# Altium schematic sheet PowerManagement.SchDoc: Teknofest Project
size 381 x 241 mm; SheetNumber: 3; SheetTotal: 4; Prepared by: Mustafa Oğuz Ateş
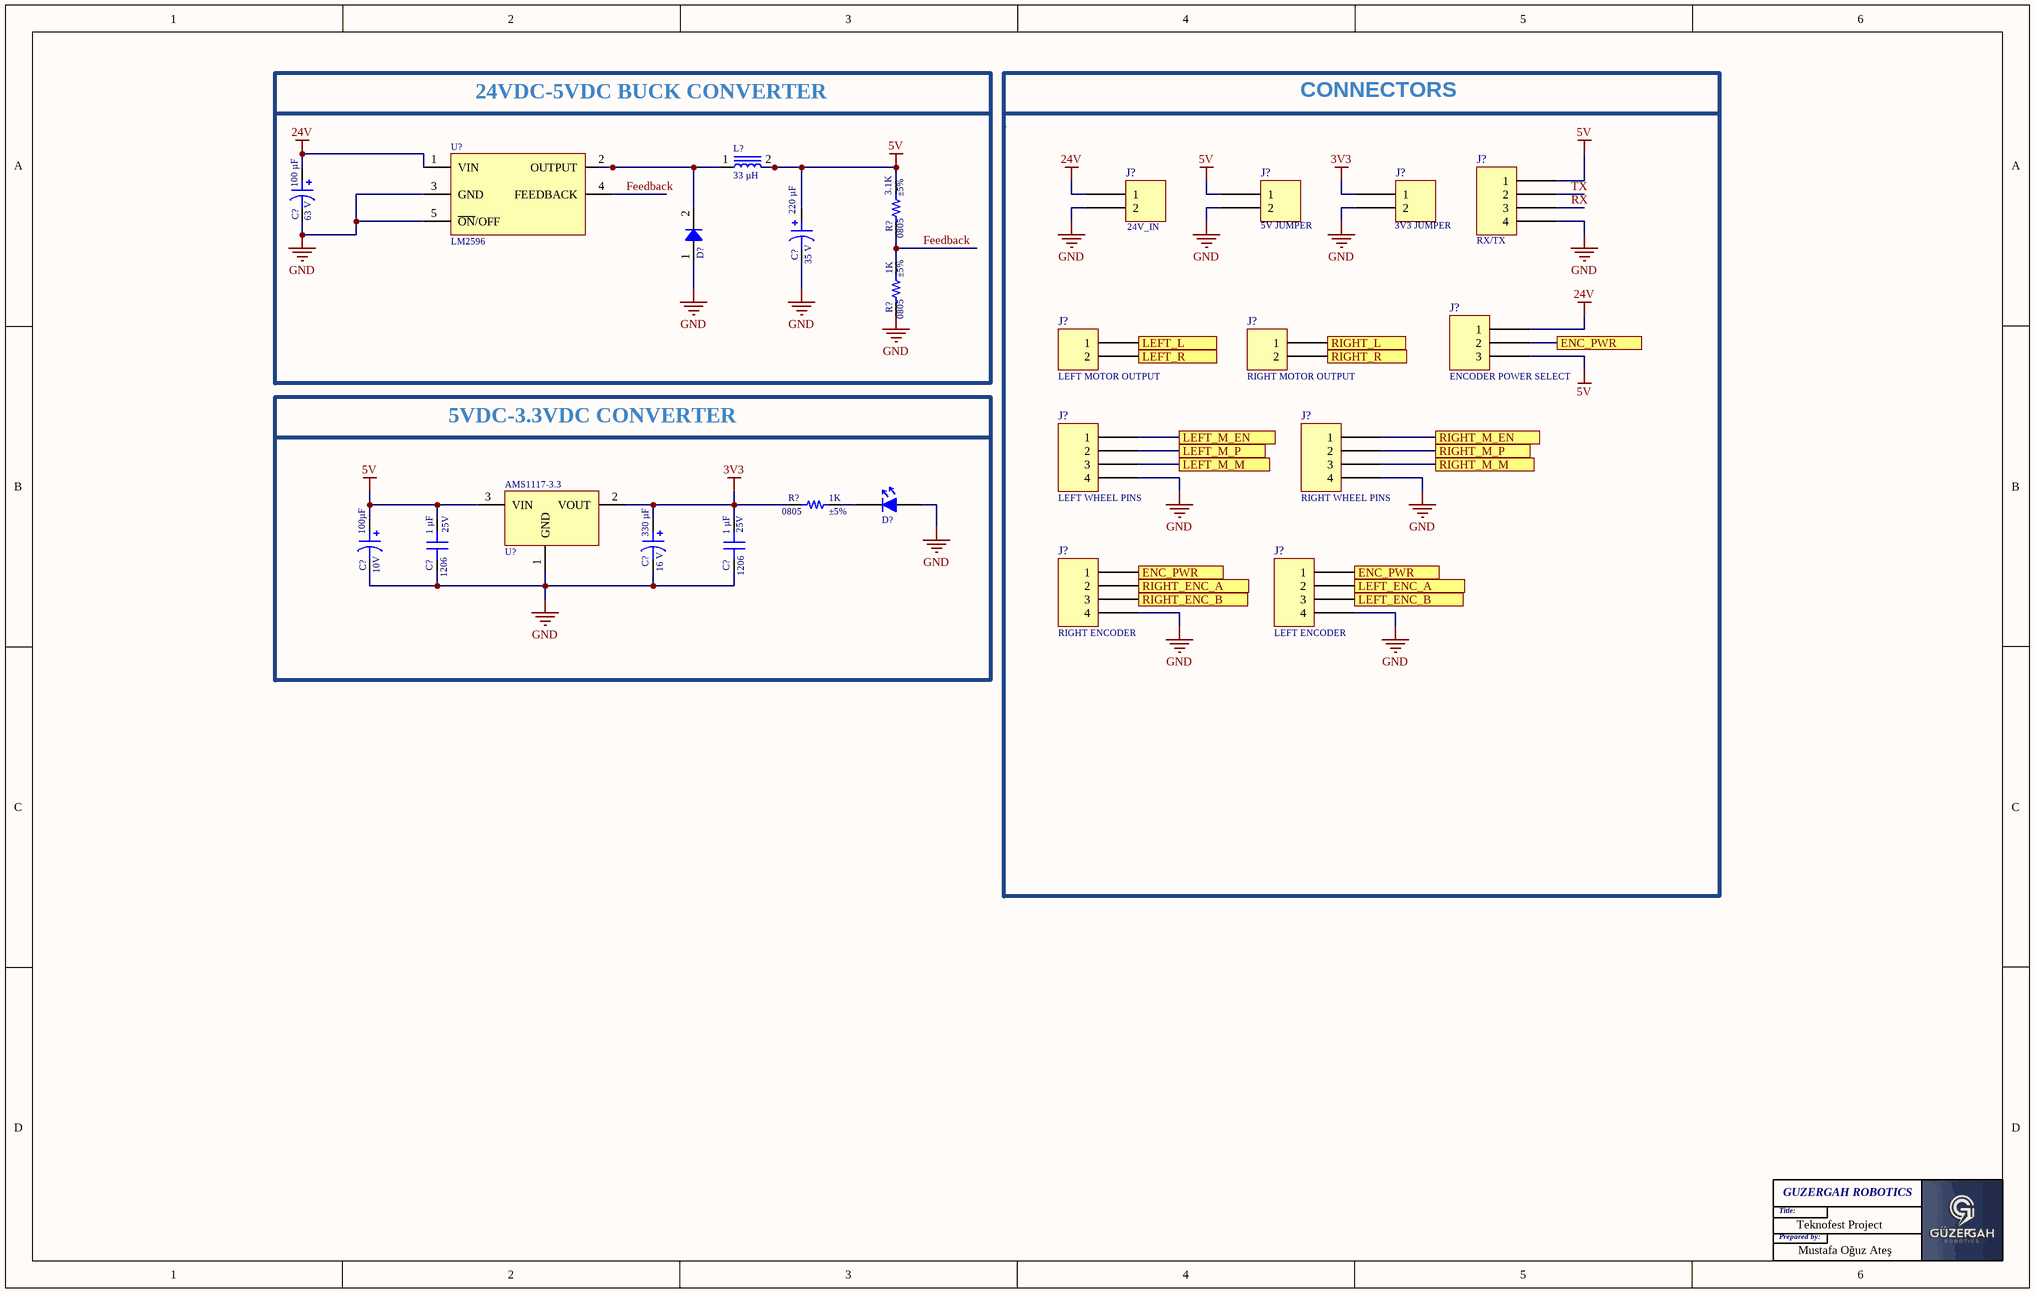
[diagram p0: PowerManagement.SchDoc]

## Parts
(Parts that share a designator on the sheet are numbered #1, #2 ... from top to bottom, then left to right.)
C?#1  100 µF  Voltage - Rated: 63 V  [CAP AL TH D8 L3.5 H12.5]
C?#2  220 µF  Voltage - Rated: 35 V  [CAP AL TH D8 L3.5 H12.5]
C?#3  100µF  Voltage - Rated: 10V  [CAP TH ALUM ELEC D6.30mm S2.50mm H12.50mm]
C?#4  Device Package: 1206  Voltage - Rated: 25V  [CAP 1206_3216 - 0.8MM]  (hidden comment: 1 µF)
C?#5  330 µF  Voltage - Rated: 16 V  [CAP AL TH D8 L3.5 H12.5]
C?#6  Package / Case: 1206  Voltage - Rated: 25V  [CAP 1206_3216 - 0.8MM]  (hidden comment: 1 µF)
D?#1  ACDBA560-HF  [DO214AC SMA]  (value not drawn)
D?#2  LH R974-LP-1  [LED_RED_0805]  (value not drawn)
J?#1  24V_IN  [HARWIN M20-7820245]
J?#2  5V JUMPER  [HARWIN M20-7820245]
J?#3  3V3 JUMPER  [HARWIN M20-7820245]
J?#4  RX/TX  [SULLINS NPPN041BFCN]
J?#5  LEFT MOTOR OUTPUT  [HARWIN M20-7820245]
J?#6  RIGHT MOTOR OUTPUT  [HARWIN M20-7820245]
J?#7  ENCODER POWER SELECT  [SULLINS NPPN031BFCN]
J?#8  LEFT WHEEL PINS  [SULLINS NPPN041BFCN]
J?#9  RIGHT WHEEL PINS  [SULLINS NPPN041BFCN]
J?#10  RIGHT ENCODER  [SULLINS NPPN041BFCN]
J?#11  LEFT ENCODER  [SULLINS NPPN041BFCN]
L?  33 µH  [BOURNS SRR1280]
R?#1  Package / Case: 0805  Tolerance: ±5%  [RES 0805_2012]  (hidden comment: 3.1K)
R?#2  Package / Case: 0805  Tolerance: ±5%  [RES 0805_2012]  (hidden comment: 1K)
R?#3  Package / Case: 0805  Tolerance: ±5%  [RES 0805_2012]  (hidden comment: 1K)
U?#1  LM2596  [D2PAK]
U?#2  AMS1117-3.3  [SOT-223]

## Blocks framed on the sheet
24VDC-5VDC BUCK CONVERTER: C?#1 C?#2 D?#1 L? R?#1 R?#2 U?#1
CONNECTORS: J?#1-J?#11
5VDC-3.3VDC CONVERTER: C?#3-C?#6 D?#2 R?#3 U?#2

## Ports
ENC_PWR, LEFT_ENC_A, LEFT_ENC_B, LEFT_L, LEFT_M_EN, LEFT_M_M, LEFT_M_P, LEFT_R, RIGHT_ENC_A, RIGHT_ENC_B, RIGHT_L, RIGHT_M_EN, RIGHT_M_M, RIGHT_M_P, RIGHT_R

## Nets
3V3: C?#5.1 C?#6.2 J?#3.1 R?#3.1 U?#2.2(VOUT)
5V: C?#2.1 C?#3.1 C?#4.2 J?#2.1 J?#4.1 J?#7.3 L?.2 R?#1.2 U?#2.3(VIN)
24V: C?#1.1 J?#1.1 J?#7.1 U?#1.1(VIN)
GND: C?#1.2 C?#2.2 C?#3.2 C?#4.1 C?#5.2 C?#6.1 D?#1.1 D?#2.2 J?#1.2 J?#2.2 J?#3.2 J?#4.4 J?#8.4 J?#9.4 J?#10.4 J?#11.4 R?#2.1 U?#1.3(GND) U?#1.5(~{ON}/OFF) U?#2.1(GND)
ENC_PWR: J?#7.2 J?#10.1 J?#11.1 ; port ENC_PWR
Feedback: R?#1.1 R?#2.2 U?#1.4(FEEDBACK)
LEFT_ENC_A: J?#11.2 ; port LEFT_ENC_A
LEFT_ENC_B: J?#11.3 ; port LEFT_ENC_B
LEFT_L: J?#5.1 ; port LEFT_L
LEFT_M_EN: J?#8.1 ; port LEFT_M_EN
LEFT_M_M: J?#8.3 ; port LEFT_M_M
LEFT_M_P: J?#8.2 ; port LEFT_M_P
LEFT_R: J?#5.2 ; port LEFT_R
RIGHT_ENC_A: J?#10.2 ; port RIGHT_ENC_A
RIGHT_ENC_B: J?#10.3 ; port RIGHT_ENC_B
RIGHT_L: J?#6.1 ; port RIGHT_L
RIGHT_M_EN: J?#9.1 ; port RIGHT_M_EN
RIGHT_M_M: J?#9.3 ; port RIGHT_M_M
RIGHT_M_P: J?#9.2 ; port RIGHT_M_P
RIGHT_R: J?#6.2 ; port RIGHT_R
RX: J?#4.3
TX: J?#4.2
NetD?#1_2: D?#1.2 L?.1 U?#1.2(OUTPUT)
NetD?#2_1: D?#2.1 R?#3.2

## Notes on the sheet
- Title:
- Prepared by:
- GUZERGAH ROBOTICS
- (in symbol AMS1117-3.3) /

## Library data of the parts
C?#1 = ECA-1JM101: CAP ALUM 100UF 20% 63V RADIAL; manufacturer: Panasonic Electronic Components; Lifetime @ Temp.: 2000 Hrs @ 85°C; Polarization: Polar; Ripple Current @ High Frequency: 459 mA @ 10 kHz; Ripple Current @ Low Frequency: 270 mA @ 120 Hz; Part Number: ECA-1JM101; Applications: General Purpose; Capacitance: 100 µF; componentlink1description: Datasheet; componentlink1url: //media.digikey.com/pdf/Data%20Sheets/Panasonic%20Electronic%20Components/ECA-xxM%20Series,TypeA.pdf; componentlink2description: DigiKey Link; componentlink2url: https://www.digikey.com/en/products/detail/panasonic-electronic-components/ECA-1JM101/245052; Device Package: Radial, Can; Height - Seated (Max): 0.492" (12.50mm); lastupdated: 14.12.2023 21:37:37; Lead Spacing: 0.138" (3.50mm); Lifecycle Status: Active; Minimum Order: 1; Mounting Type: Through Hole; Operating Temperature: -40°C ~ 85°C; Package / Case: Radial, Can; packaging: Bulk; partid: 7225; Part Status: Active; price: 0.11; series: M-A; Size / Dimension: 0.315" Dia (8.00mm); Supplier 1: DigiKey; Supplier Part Number 1: P5193-ND; Tolerance: ±20%; value: 100 µF
C?#2 = ECA-1VM221: CAP ALUM 220UF 20% 35V RADIAL; manufacturer: Panasonic Electronic Components; Lifetime @ Temp.: 2000 Hrs @ 85°C; Polarization: Polar; Ripple Current @ High Frequency: 595 mA @ 10 kHz; Ripple Current @ Low Frequency: 350 mA @ 120 Hz; Part Number: ECA-1VM221; Applications: General Purpose; Capacitance: 220 µF; componentlink1description: Datasheet; componentlink1url: //media.digikey.com/pdf/Data%20Sheets/Panasonic%20Electronic%20Components/ECA-xxM%20Series,TypeA.pdf; componentlink2description: DigiKey Link; componentlink2url: https://www.digikey.com/en/products/detail/panasonic-electronic-components/ECA-1VM221/245025; Device Package: Radial, Can; Height - Seated (Max): 0.492" (12.50mm); lastupdated: 14.12.2023 21:37:36; Lead Spacing: 0.138" (3.50mm); Lifecycle Status: Active; Minimum Order: 1; Mounting Type: Through Hole; Operating Temperature: -40°C ~ 85°C; Package / Case: Radial, Can; packaging: Bulk; partid: 7280; Part Status: Active; price: 0.09; series: M-A; Size / Dimension: 0.315" Dia (8.00mm); Supplier 1: DigiKey; Supplier Part Number 1: P5166-ND; Tolerance: ±20%; value: 220 µF
C?#3 = UPJ1A101MED1TD: CAP ALUM 100UF 20% 10V RADIAL; manufacturer: Nichicon; Impedance: 840 mOhms; Lifetime @ Temp.: 2000 Hrs @ 105°C; Polarization: Polar; Ripple Current @ High Frequency: 210mA @ 10kHz; Ripple Current @ Low Frequency: 135mA @ 120Hz; Part Number: UPJ1A101MED1TD; Applications: General Purpose; Capacitance: 100µF; componentlink1description: Datasheet; componentlink1url: http://nichicon-us.com/english/products/pdfs/e-upj.pdf; componentlink2description: DigiKey Link; componentlink2url: http://digikey.com/product-detail/en/nichicon/UPJ1A101MED1TD/493-11407-1-ND/4319405; Device Package: Radial, Can; Height - Seated (Max): 0.492" (12.50mm); lastupdated: 4.09.2020 01:05:49; Lead Spacing: 0.098" (2.50mm); Lifecycle Status: Active; Minimum Order: 1; Mounting Type: Through Hole; Operating Temperature: -55°C ~ 105°C; Package / Case: Radial, Can; packaging: TapeAndBox; partid: 20688; Part Status: Active; price: 0.06; series: UPJ; Size / Dimension: 0.248" Dia (6.30mm); Supplier 1: DigiKey; Supplier Part Number 1: 493-11407-1-ND; Tolerance: ±20%; value: 100µF
C?#4 C?#6 = CC1206KKX7R8BB105: CAP CER 1UF 25V X7R 1206; manufacturer: Yageo; Tolerance: ±10%; Part Number: CC1206KKX7R8BB105; Value: 1 µF; Applications: General Purpose; Capacitance: 1 µF; componentlink1description: Datasheet; componentlink1url: https://www.yageo.com/upload/media/product/productsearch/datasheet/mlcc/UPY-GPHC_X7R_6.3V-to-50V_18.pdf; componentlink2description: DigiKey Link; componentlink2url: https://www.digikey.com/en/products/detail/yageo/CC1206KKX7R8BB105/2103094; lastupdated: 5.02.2024 20:18:27; Lifecycle Status: Active; Minimum Order: 1; Mounting Type: Surface Mount, MLCC; Operating Temperature: -55°C ~ 125°C; packaging: TapeAndReel; partid: 18923; Part Status: Active; price: 0.03; series: CC; Size / Dimension: 0.126" L x 0.063" W (3.20mm x 1.60mm); Supplier 1: DigiKey; Supplier Part Number 1: 311-1356-1-ND; Temperature Coefficient: X7R; Thickness (Max): 0.045" (1.15mm)
  C?#4: Package / Case: 1206 (3216 Metric)
  C?#6: Device Package: 1206 (3216 Metric)
C?#5 = UKW1C331MPD1TD: CAP ALUM 330UF 20% 16V RADIAL; manufacturer: Nichicon; Lifetime @ Temp.: 2000 Hrs @ 85°C; Polarization: Polar; Ripple Current @ Low Frequency: 360 mA @ 120 Hz; Part Number: UKW1C331MPD1TD; Applications: Audio; Capacitance: 330 µF; componentlink1description: Datasheet; componentlink1url: http://nichicon-us.com/english/products/pdfs/e-ukw.pdf; componentlink2description: DigiKey Link; componentlink2url: https://www.digikey.com/en/products/detail/nichicon/UKW1C331MPD1TD/4317335; Device Package: Radial, Can; Height - Seated (Max): 0.492" (12.50mm); lastupdated: 3.06.2024 20:06:12; Lead Spacing: 0.138" (3.50mm); Lifecycle Status: Active; Minimum Order: 1; Mounting Type: Through Hole; Operating Temperature: -40°C ~ 85°C; Package / Case: Radial, Can; packaging: TapeAndBox; partid: 7215; Part Status: Active; price: 0.23; series: UKW; Size / Dimension: 0.315" Dia (8.00mm); Supplier 1: DigiKey; Supplier Part Number 1: 493-10757-1-ND; Tolerance: ±20%; value: 330 µF
D?#1 = ACDBA560-HF: DIODE SCHOTTKY 60V 5A DO214AC; Manufacturer: Comchip Technology; Capacitance @ Vr, F: 250pF @ 4V, 1MHz; Current - Reverse Leakage @ Vr: 500 µA @ 60 V; Speed: Fast Recovery =< 500ns, > 200mA (Io); Voltage - Forward (Vf) (Max) @ If: 700 mV @ 5 A; Part Number: ACDBA560-HF; ComponentLink1Description: Datasheet; ComponentLink1URL: http://www.comchiptech.com/admin/files/product/ACDBA560-HF%20RevA201382.pdf; ComponentLink2Description: DigiKey Link; ComponentLink2URL: https://www.digikey.com/en/products/detail/comchip-technology/ACDBA560-HF/7100903; Current - Average Rectified (Io): 5A; Diode Type: Schottky; LastUpdated: 14.12.2023 21:25:59; Lifecycle Status: Active; Minimum Order: 1; Mounting Type: Surface Mount; Operating Temperature - Junction: -55°C ~ 125°C; Package / Case: DO-214AC, SMA; Packaging: TapeAndReel; PartId: 1832; Part Status: Active; Price: 0.15; Series: -; Supplier 1: DigiKey; Supplier Part Number 1: 641-2078-1-ND; Supplier Device Package: DO-214AC (SMA); Voltage - DC Reverse (Vr) (Max): 60 V
D?#2 = LED RED 0805: LED Uni-Color Hyper Red 660nm 2-Pin Chip 0805(2012Metric) T/R; Manufacturer: Osram Opto; Lens Color: White; Forward Voltage: 1.8V; Lens Style: Diffused,Flat,Colorless; Luminous Intensity: 71mcd; Viewing Angle: 160°; Forward Current: 30mA; Dominant Wavelength: 645nm; Number of Elements: 1; Test Current: 20mA; Reverse Voltage: 5V; Lens Transparency: Diffused; Luminous Flux: 0.17lm; Lens Size: 1.25mm; Designed by: Mustafa; Supplier 1: Digi-Key; Manufacturer Part Number: LH R974-LP-1; RoHS: Yes; Category: LEDs; Stock 1: 35632; Pricing 1: 1=0,26000, 10=0,13900, 100=0,06480, 500=0,05978, 1000=0,04683, 2000=0,04584 (USD); Mount: Surface Mount; Case/Package: 0805; Number of Pins: 2; Color: Red; Case Code (Imperial): 0805; Case Code (Metric): 2012; Min Operating Temperature: -30°C; Max Operating Temperature: 85°C; Packaging: Tape and Reel; Illumination Color: Red; Package Quantity: 1; Series: CHipLED; Length: 2.1mm; Width: 1.25mm; Depth: 1.35mm; Radiation Hardening: No; RoHS Compliant: Yes; ComponentLink1URL: http://www.jameco.com/Jameco/Products/ProdDS/2085634.pdf?src-supplier=Jameco; ComponentLink1Description: http://www.jameco.com/Jameco/Products/ProdDS/2085634.pdf?src-supplier=Jameco; ComponentLink2URL: http://components.arrow.com/part/dataview/0323_01825492?src-supplier=Arrow+Europe; ComponentLink2Description: http://components.arrow.com/part/dataview/0323_01825492?src-supplier=Arrow+Europe; ComponentLink3URL: https://dammedia.osram.info/media/resource/hires/osram-dam-2493888/LH%20R974.pdf?src-supplier=Digi-Key; ComponentLink3Description: https://dammedia.osram.info/media/resource/hires/osram-dam-2493888/LH%20R974.pdf?src-supplier=Digi-Key; ComponentLink4URL: http://www.mouser.com/ds/2/311/LH%20R974%20-%20CHIPLED%200805-318659.pdf?src-supplier=Mouser; ComponentLink4Description: http://www.mouser.com/ds/2/311/LH%20R974%20-%20CHIPLED%200805-318659.pdf?src-supplier=Mouser; ComponentLink5URL: https://www.verical.com/server-webapp/html/getDatasheet?partID=258950&src-supplier=Verical; ComponentLink5Description: https://www.verical.com/server-webapp/html/getDatasheet?partID=258950&src-supplier=Verical; ComponentLink6URL: http://components.arrow.com/part/dataview/41971690S1077610N9133?src-supplier=Arrow+Electronics; ComponentLink6Description: http://components.arrow.com/part/dataview/41971690S1077610N9133?src-supplier=Arrow+Electronics; ComponentLink7URL: http://components.arrow.com/part/dataview/41971690S6190115N2128?src-supplier=Arrow+Electronics; ComponentLink7Description: http://components.arrow.com/part/dataview/41971690S6190115N2128?src-supplier=Arrow+Electronics; Supplier Part Number 1: 475-1415-1-ND
J?#1-J?#3 J?#5 J?#6 = M20-7820242: CONN RCPT 2POS 0.1 GOLD PCB; Part Number: M20-7820242
J?#4 J?#8 J?#9 = NPPN041BFCN-RC: CONN HDR 4POS 0.079 GOLD PCB; Part Number: NPPN041BFCN-RC
J?#7 = NPPN031BFCN-RC: CONN HDR 3POS 0.079 GOLD PCB; Part Number: NPPN031BFCN-RC
J?#10 J?#11 = NPPN041BFCN-RC: CONN HDR 4POS 0.079 GOLD PCB; Manufacturer: Sullins Connector Solutions; Connector Type: Header; Contact Length - Post: 0.094" (2.40mm); Current Rating (Amps): 2A; Material Flammability Rating: UL94 V-0; Number of Positions: 4; Number of Positions Loaded: All; Pitch - Mating: 0.079" (2.00mm); Style: Board to Board; Part Number: NPPN041BFCN-RC; ComponentLink1Description: Datasheet; ComponentLink1URL: https://drawings-pdf.s3.amazonaws.com/10483.pdf; ComponentLink2Description: DigiKey Link; ComponentLink2URL: https://www.digikey.com/en/products/detail/sullins-connector-solutions/NPPN041BFCN-RC/804806; Contact Finish - Mating: Gold; Contact Finish - Post: Gold; Contact Finish Thickness - Mating: Flash; Contact Type: Female Socket; Fastening Type: Push-Pull; Insulation Color: Black; Insulation Height: 0.173" (4.40mm); LastUpdated: 21.06.2022 14:42:51; Lifecycle Status: Active; Minimum Order: 1; Mounting Type: Through Hole; Number of Rows: 1; Operating Temperature: -40°C ~ 105°C; Packaging: Tube; Part Status: Active; Price: 0.30; Series: -; Supplier 1: DigiKey; Supplier Part Number 1: S5751-04-ND; Termination: Solder
L? = SRR1280-330M: FIXED IND 33UH 3.5A 57 MOHM SMD; Manufacturer: Bourns Inc.; Current - Saturation: 3.3A; DC Resistance (DCR): 57mOhm Max; Frequency - Self Resonant: 9.5MHz; Inductance Frequency - Test: 100 kHz; Material - Core: Ferrite; Q @ Freq: 28 @ 2.52MHz; Shielding: Shielded; Tolerance: ±20%; Type: Drum Core, Wirewound; Part Number: SRR1280-330M; ComponentLink1Description: Datasheet; ComponentLink1URL: https://www.bourns.com/docs/Product-Datasheets/SRR1280.pdf; ComponentLink2Description: DigiKey Link; ComponentLink2URL: https://www.digikey.com/en/products/detail/bourns-inc/SRR1280-330M/1969998; Current Rating (Amps): 3.5 A; Device Package: Nonstandard; Height - Seated (Max): 0.315" (8.00mm); Inductance: 33 µH; LastUpdated: 14.12.2023 21:34:16; Lifecycle Status: Active; Minimum Order: 1; Mounting Type: Surface Mount; Operating Temperature: -40°C ~ 125°C; Package / Case: Nonstandard; Packaging: TapeAndReel; PartId: 25; Part Status: Active; Price: 0.51; Series: SRR1280; Size / Dimension: 0.492" L x 0.492" W (12.50mm x 12.50mm); Supplier 1: DigiKey; Supplier Part Number 1: SRR1280-330MCT-ND; Value: 33 µH
R?#1-R?#3 = ERJ-6GEYJ331V: RES SMD 330 OHM 5% 1/8W 0805; Manufacturer: Panasonic Electronic Components; Power (Watts): 0.125W, 1/8W; Temperature Coefficient: ±200ppm/°C; Part Number: ERJ-6GEYJ331V; ComponentLink1Description: Datasheet; ComponentLink1URL: http://industrial.panasonic.com/www-cgi/jvcr13pz.cgi?E+PZ+3+AOA0001+ERJ6GEYJ331V+7+WW; ComponentLink2Description: DigiKey Link; ComponentLink2URL: https://www.digikey.com/en/products/detail/panasonic-electronic-components/ERJ-6GEYJ331V/89726; Composition: Thick Film; Device Package: 0805 (2012 Metric); Features: Automotive AEC-Q200; Height - Seated (Max): 0.028" (0.70mm); LastUpdated: 6.02.2024 21:02:13; Lifecycle Status: Active; Minimum Order: 1; Number of Terminations: 2; Operating Temperature: -55°C ~ 155°C; Packaging: TapeAndReel; PartId: 30017; Part Status: Active; Price: 0.01; Ratings: AEC-Q200; Series: ERJ-6G; Size / Dimension: 0.079" L x 0.049" W (2.00mm x 1.25mm); Supplier 1: DigiKey; Supplier Part Number 1: P330ACT-ND; Supplier Device Package: 0805
  R?#1: Value: 3.1K; Resistance: 3.1K
  R?#2 R?#3: Value: 1K; Resistance: 1K
U?#2 = AMS1117-3.3: IC-1117 V.REG. 1A 3V3 SOT223 SMD AMS; Manufacturer: UMW(Youtai Semiconductor Co., Ltd.); Designed by: Mustafa oğuz Ateş; Supplier: Digikey; Supplier Part Number: 4518-AMS1117-3.3CT-ND; Manufacturer Part Number: AMS1117-3.3; RoHS: No; Category: Uncategorized; Pricing: 1=0,48, 10=0,388, 25=0,3552, 100=0,2644, 250=0,2396, 500=0,19828, 1000=0,14871 (USD)